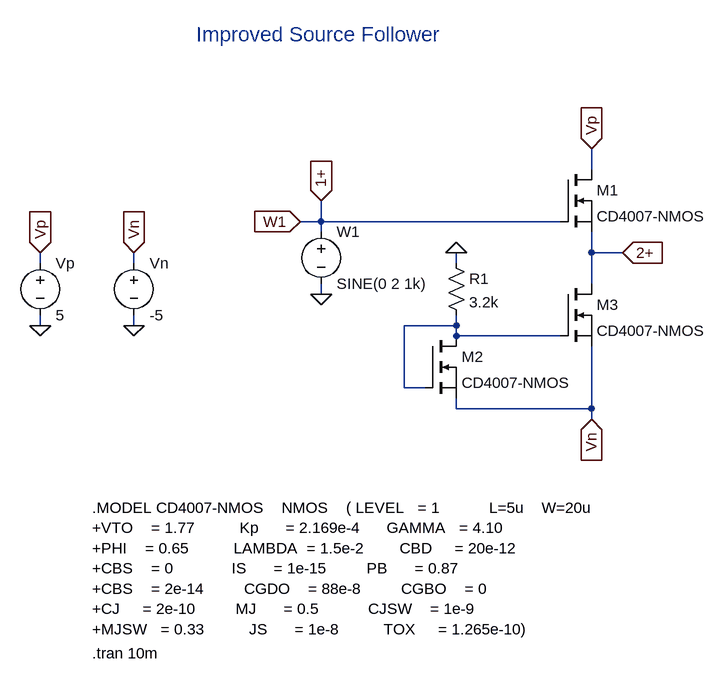
[diagram p0: schematic imp_mos_src_flw_ltspice.asc]
imp_mos_src_flw_ltspice.asc, the LTspice schematic file:
Version 4
SHEET 1 880 856
WIRE 528 96 528 64
WIRE 112 176 112 144
WIRE 112 176 80 176
WIRE 480 176 112 176
WIRE 112 192 112 176
WIRE 528 224 528 192
WIRE 576 224 528 224
WIRE -320 240 -320 224
WIRE -176 240 -176 224
WIRE 320 240 320 224
WIRE 528 272 528 224
WIRE 112 288 112 272
WIRE -320 336 -320 320
WIRE -176 336 -176 320
WIRE 320 336 320 320
WIRE 320 336 240 336
WIRE 320 352 320 336
WIRE 480 352 320 352
WIRE 240 432 240 336
WIRE 272 432 240 432
WIRE 320 464 320 448
WIRE 528 464 528 368
WIRE 528 464 320 464
WIRE 528 480 528 464
FLAG 320 224 0
FLAG 528 64 Vp
IOPIN 528 64 In
FLAG 528 480 Vn
IOPIN 528 480 In
FLAG 80 176 W1
IOPIN 80 176 In
FLAG 576 224 2+
IOPIN 576 224 In
FLAG 112 144 1+
IOPIN 112 144 In
FLAG 112 288 0
FLAG -320 336 0
FLAG -176 336 0
FLAG -320 224 Vp
IOPIN -320 224 In
FLAG -176 224 Vn
IOPIN -176 224 In
SYMBOL nmos 480 96 R0
SYMATTR InstName M1
SYMATTR Value CD4007-NMOS
SYMBOL nmos 272 352 R0
SYMATTR InstName M2
SYMATTR Value CD4007-NMOS
SYMBOL nmos 480 272 R0
SYMATTR InstName M3
SYMATTR Value CD4007-NMOS
SYMBOL res 304 224 R0
SYMATTR InstName R1
SYMATTR Value 3.2k
SYMBOL voltage 112 176 R0
WINDOW 123 0 0 Left 0
WINDOW 39 0 0 Left 0
SYMATTR InstName W1
SYMATTR Value SINE(0 2 1k)
SYMBOL voltage -176 224 R0
WINDOW 123 0 0 Left 0
WINDOW 39 0 0 Left 0
SYMATTR InstName Vn
SYMATTR Value -5
SYMBOL voltage -320 224 R0
WINDOW 123 0 0 Left 0
WINDOW 39 0 0 Left 0
SYMATTR InstName Vp
SYMATTR Value 5
TEXT -80 -112 Left 3 ;Improved Source Follower
TEXT -240 616 Left 2 !.MODEL CD4007-NMOS    NMOS    ( LEVEL   = 1           L=5u    W=20u             \n+VTO    = 1.77          Kp      = 2.169e-4      GAMMA   = 4.10  \n+PHI    = 0.65          LAMBDA  = 1.5e-2        CBD     = 20e-12\n+CBS    = 0             IS      = 1e-15         PB      = 0.87\n+CBS    = 2e-14         CGDO    = 88e-8         CGBO    = 0\n+CJ     = 2e-10         MJ      = 0.5           CJSW    = 1e-9\n+MJSW   = 0.33          JS      = 1e-8          TOX     = 1.265e-10)
TEXT -240 840 Left 2 !.tran 10m

The netlist it stands for:
* imp_mos_src_flw_ltspice.asc
M1 Vp 1+ 2+ 2+ CD4007-NMOS
M2 N001 N001 Vn Vn CD4007-NMOS
M3 2+ N001 Vn Vn CD4007-NMOS
R1 0 N001 3.2k
V§W1 1+ 0 SINE(0 2 1k)
Vn Vn 0 -5
Vp Vp 0 5
.model NMOS NMOS
.model PMOS PMOS
.lib standard.mos
* Improved Source Follower
.MODEL CD4007-NMOS    NMOS    ( LEVEL   = 1           L=5u    W=20u
+VTO    = 1.77          Kp      = 2.169e-4      GAMMA   = 4.10
+PHI    = 0.65          LAMBDA  = 1.5e-2        CBD     = 20e-12
+CBS    = 0             IS      = 1e-15         PB      = 0.87
+CBS    = 2e-14         CGDO    = 88e-8         CGBO    = 0
+CJ     = 2e-10         MJ      = 0.5           CJSW    = 1e-9
+MJSW   = 0.33          JS      = 1e-8          TOX     = 1.265e-10)
.tran 10m
.backanno
.end